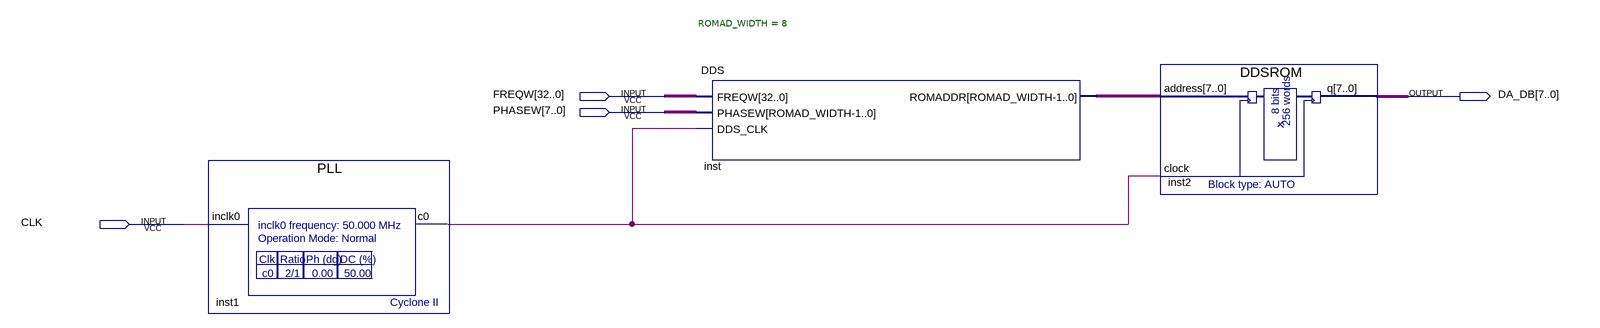
[diagram p0: schematic sheet]
// Quartus schematic DDS_TOP.bdf as structural Verilog: 3 symbols, 4 pins
module DDS_TOP (
  input  [32:0] FREQW,
  input  [7:0] PHASEW,
  input  CLK,
  output [7:0] DA_DB
);

  wire inst1_c0;
  wire [7:0] inst_romaddr;

  PLL inst1 (.inclk0(CLK), .c0(inst1_c0));
  DDS #(.ROMAD_WIDTH(8)) inst (.FREQW(FREQW), .PHASEW(PHASEW), .DDS_CLK(inst1_c0), .ROMADDR(inst_romaddr));
  DDSROM inst2 (.address(inst_romaddr), .clock(inst1_c0), .q(DA_DB));
endmodule
